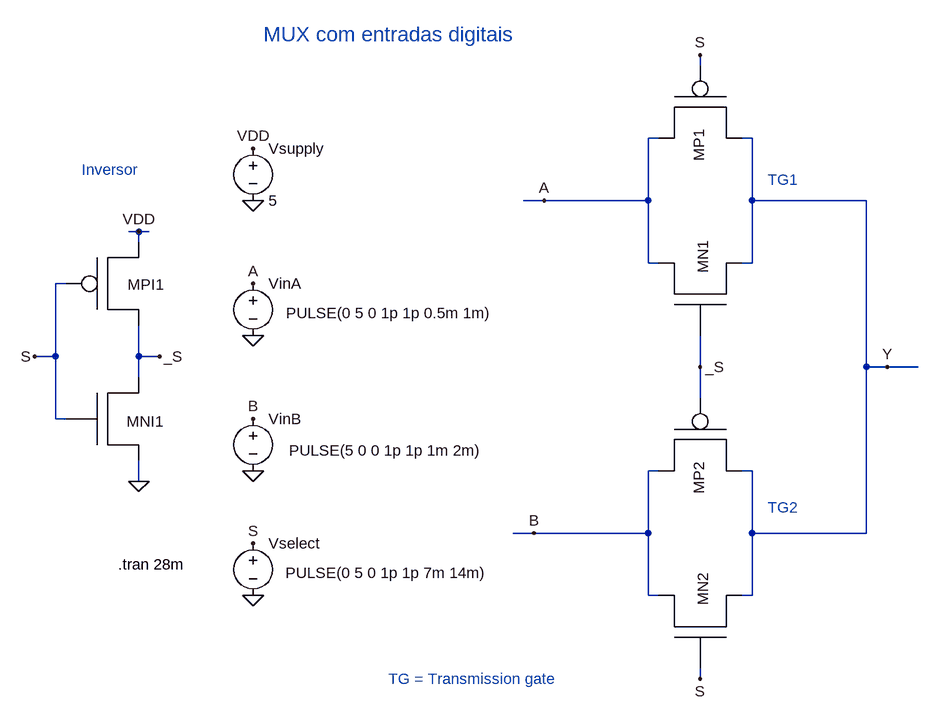
[diagram p0: schematic MUX-digital.asc]
MUX-digital.asc, the LTspice schematic file:
Version 4
SHEET 1 1468 680
WIRE 352 -656 352 -672
WIRE 288 -544 272 -544
WIRE 432 -544 416 -544
WIRE 112 -448 80 -448
WIRE 272 -448 272 -544
WIRE 272 -448 112 -448
WIRE 432 -448 432 -544
WIRE 608 -448 432 -448
WIRE -512 -400 -528 -400
WIRE -496 -400 -512 -400
WIRE -512 -384 -512 -400
WIRE 272 -352 272 -448
WIRE 288 -352 272 -352
WIRE 432 -352 432 -448
WIRE 432 -352 416 -352
WIRE -624 -320 -640 -320
WIRE -640 -208 -640 -320
WIRE -640 -208 -672 -208
WIRE -512 -208 -512 -256
WIRE -480 -208 -512 -208
WIRE 352 -192 352 -240
WIRE 608 -192 608 -448
WIRE 640 -192 608 -192
WIRE 688 -192 640 -192
WIRE -512 -176 -512 -208
WIRE 352 -144 352 -192
WIRE -640 -112 -640 -208
WIRE -624 -112 -640 -112
WIRE 288 -32 272 -32
WIRE 432 -32 416 -32
WIRE -512 -16 -512 -48
WIRE 96 64 64 64
WIRE 272 64 272 -32
WIRE 272 64 96 64
WIRE 432 64 432 -32
WIRE 608 64 608 -192
WIRE 608 64 432 64
WIRE 272 160 272 64
WIRE 288 160 272 160
WIRE 432 160 432 64
WIRE 432 160 416 160
WIRE 352 288 352 272
FLAG -336 -528 VDD
FLAG -336 -448 0
FLAG -336 -240 0
FLAG -336 -32 0
FLAG -336 160 0
FLAG -336 -320 A
FLAG -336 -112 B
FLAG -336 80 S
FLAG 112 -448 A
FLAG 96 64 B
FLAG 352 -672 S
FLAG 352 288 S
FLAG 352 -192 _S
FLAG 640 -192 Y
FLAG -512 -400 VDD
FLAG -672 -208 S
FLAG -480 -208 _S
FLAG -512 -16 0
SYMBOL voltage -336 -336 R0
WINDOW 3 51 61 Left 2
WINDOW 123 0 0 Left 2
WINDOW 39 0 0 Left 2
SYMATTR Value PULSE(0 5 0 1p 1p 0.5m 1m)
SYMATTR InstName VinA
SYMBOL voltage -336 -128 R0
WINDOW 3 55 65 Left 2
WINDOW 123 0 0 Left 2
WINDOW 39 0 0 Left 2
SYMATTR Value PULSE(5 0 0 1p 1p 1m 2m)
SYMATTR InstName VinB
SYMBOL voltage -336 -544 R0
SYMATTR InstName Vsupply
SYMATTR Value 5
SYMBOL voltage -336 64 R0
WINDOW 3 50 61 Left 2
WINDOW 123 0 0 Left 2
WINDOW 39 0 0 Left 2
SYMATTR Value PULSE(0 5 0 1p 1p 7m 14m)
SYMATTR InstName Vselect
SYMBOL PMOSX 368 -576 R90
SYMATTR InstName MP1
SYMBOL NMOSX 336 -320 R270
SYMATTR InstName MN1
SYMBOL PMOSX 368 -64 R90
SYMATTR InstName MP2
SYMBOL NMOSX 336 192 R270
SYMATTR InstName MN2
SYMBOL PMOSX -544 -336 R0
SYMATTR InstName MPI1
SYMBOL NMOSX -544 -128 R0
SYMATTR InstName MNI1
TEXT -544 112 Left 2 !.tran 28m
TEXT -320 -704 Left 3 ;MUX com entradas digitais
TEXT -128 288 Left 2 ;TG = Transmission gate
TEXT 456 -480 Left 2 ;TG1
TEXT 456 24 Left 2 ;TG2
TEXT -600 -496 Left 2 ;Inversor

The netlist it stands for:
* MUX-digital.asc
VinA A 0 PULSE(0 5 0 1p 1p 0.5m 1m)
VinB B 0 PULSE(5 0 0 1p 1p 1m 2m)
Vsupply VDD 0 5
Vselect S 0 PULSE(0 5 0 1p 1p 7m 14m)
XMP1 A S Y PMOSX  ; pins D G S
XMN1 A _S Y NMOSX  ; pins D G S
XMP2 B _S Y PMOSX  ; pins D G S
XMN2 B S Y NMOSX  ; pins D G S
XMPI1 _S S VDD PMOSX  ; pins D G S
XMNI1 _S S 0 NMOSX  ; pins D G S
.tran 28m
* MUX com entradas digitais
* TG = Transmission gate
* TG1
* TG2
* Inversor
.lib MOS4007.txt
.backanno
.end